# Altium schematic sheet RF_Bypass.SchDoc
size 279 x 215 mm; SheetNumber: 6; SheetTotal: 6
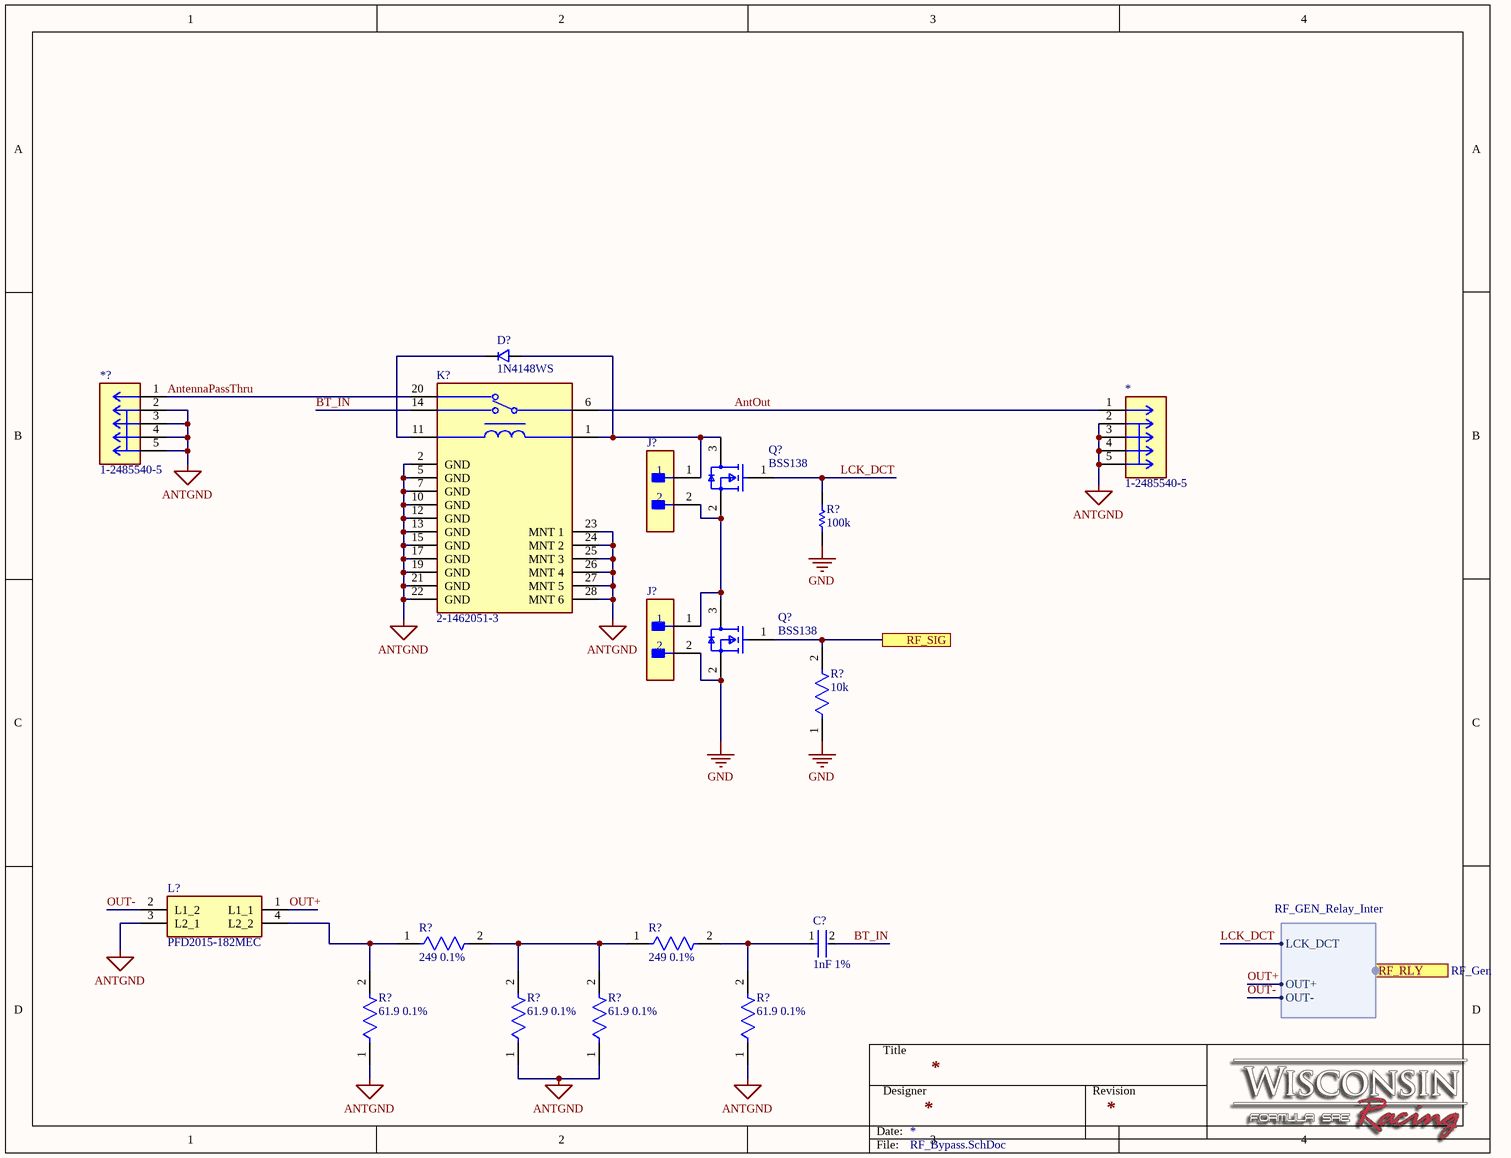
[diagram p0: RF_Bypass.SchDoc]

## Parts
(Parts that share a designator on the sheet are numbered #1, #2 ... from top to bottom, then left to right.)
*  1-2485540-5  [1-2485540-5-Footprint-1]
*?  1-2485540-5  [1-2485540-5-Footprint-1]
C?  1nF 1%  [FP-GRT155-0_05-IPC_A]
D?  1N4148WS  [SODFL250X90-2N]
J?#1  TSM-102-01-T-SV-TR  [FP-TSM-102-01-T-SV-TR-MFG]  (value not drawn)
J?#2  TSM-102-01-T-SV-TR  [FP-TSM-102-01-T-SV-TR-MFG]  (value not drawn)
K?  2-1462051-3  [FP-2-1462051-3-MFG]
L?  PFD2015-182MEC  [PFD2015102MEB]
Q?#1  BSS138  [FP-318-08-IPC_B]
Q?#2  BSS138  [FP-318-08-IPC_B]
R?#1  100k  [RESC1005X40X25NL05T10]
R?#2  10k  [FP-RC0402-0_4-IPC_C]
R?#3  249 0.1%  [FP-RT0402-MFG]
R?#4  249 0.1%  [FP-RT0402-MFG]
R?#5  61.9 0.1%  [FP-RP73P-1E-MFG]
R?#6  61.9 0.1%  [FP-RP73P-1E-MFG]
R?#7  61.9 0.1%  [FP-RP73P-1E-MFG]
R?#8  61.9 0.1%  [FP-RP73P-1E-MFG]

## Ports
RF_RLY (harness RF_GEN_Relay_Inter, see RF_Gen), RF_SIG

## Harnesses
RF_GEN_Relay_Inter: LCK_DCT, OUT+, OUT-

## Nets
ANTGND: *.2 *.3 *.4 *.5 *?.2 *?.3 *?.4 *?.5 K?.2(GND) K?.5(GND) K?.7(GND) K?.10(GND) K?.12(GND) K?.13(GND) K?.15(GND) K?.17(GND) K?.19(GND) K?.21(GND) K?.22(GND) K?.23(MNT_1) K?.24(MNT_2) K?.25(MNT_3) K?.26(MNT_4) K?.27(MNT_5) K?.28(MNT_6) L?.3(L2_1) R?#5.1 R?#6.1 R?#7.1 R?#8.1
GND: J?#2.2 Q?#2.2(S) R?#1.1 R?#2.1
AntennaPassThru: *?.1 K?.20
AntOut: *.1 K?.6
BT_IN: C?.2 K?.14
LCK_DCT: Q?#1.1(G) R?#1.2 ; port RF_RLY.LCK_DCT
OUT+: port RF_RLY.OUT+
OUT-: L?.2(L1_2) ; port RF_RLY.OUT-
RF_SIG: Q?#2.1(G) R?#2.2 ; port RF_SIG
NetC?_1: C?.1 R?#4.2 R?#8.2
NetD?_1: D?.1 K?.11(-)
NetD?_2: D?.2 J?#1.1 K?.1(+) Q?#1.3(D)
NetJ?#1_2: J?#1.2 J?#2.1 Q?#1.2(S) Q?#2.3(D)
NetL?_4: L?.4(L2_2) R?#3.1 R?#5.2
NetR?#3_2: R?#3.2 R?#4.1 R?#6.2 R?#7.2

Not connected (* = marked no-connect by the designer): L? 1(L1_1)

## Notes on the sheet
- Labels drawn without touching a wire or pin: OUT+
- Title
- Designer
- Revision
- Date:
- File:

## Library data of the parts
* *? = CMP-00172-1: FAKRA Connector, Plug, 50 ohm, Locking, 6 GHz, Cable-to-Board, 1 Position, Printed Circuit Board, -40 – 105 °C [-40 – 221 °F], Solder, FAKRA
C? = CMP-06035-012909-1: Multi-Layer Ceramic Capacitor 1nF 50V C0G ±1% 0402 Paper T/R / GRT1555C1H102FA02D
D? = CMP-REC-0001-6: Diode
J?#1 J?#2 = CMP-02766-000113-1: CONN HEADER SMD 2POS 2.54MM; Gender: Male; Max Voltage Rating (AC): 475V; Number of Contacts: 2; Max Current Rating: 7A; Contact Material: Bronze; Min Operating Temperature: -55°C; REACH SVHC: No SVHC; Housing Material: Polymer; Lead Free: Lead Free; Orientation: Straight; Radiation Hardening: No; Number of Rows: 1; Length: 5.08mm; Housing Color: Black; Max Operating Temperature: 105°C; Contact Plating: Tin; Depth: 2.54mm; Packaging: Tape and Reel; Pitch: 2.54mm; Termination: Solder
K? = CMP-03396-000136-1: RELAY RF SPDT 2A 5V; Max Voltage Rating (AC): 250V; Contact Voltage Rating (DC): 220V; Operate Time: 3ms; Actuating System: DC; Release Time: 5ms; Coil Resistance: 178R; Coil Current: 28.1mA; Insertion Loss: -0.3dB; Coil Power: 140mW; Coil Type: Non-Latching; Contact Current Rating: 2A; Radiation Hardening: No; Voltage Rating (AC): 250V; ELV: Compliant; Max Voltage Rating (DC): 220V; Min Operating Temperature: -55°C; Coil Voltage (DC): 5V; Number of Pins: 22; Max Current Rating: 2A; Height: 10.5mm; Package Quantity: 250; Termination: PCB; Length: 14.9inch; RoHS Compliant: No; Packaging: Box; Width: 0.295inch; Depth: 9.4mm; Relay Type: Relay; Mount: Surface Mount; Throw Configuration: SPDT; Contact Plating: Gold; Contact Material: Nickel; Weight: 3oz; Series: HF3S, AXICOM; Max Operating Temperature: 85°C
L? = PFD2015-102MEB: Inductor; Manufacturer_Name: COILCRAFT; Datasheet Link: https://www.coilcraft.com/pdfs/pfd2015_flyback.pdf; Height: 1.5mm; Manufacturer_Part_Number: PFD2015-102MEB; Mouser Part Number: 994-PFD2015-102MEB; Mouser Price/Stock: https://www.mouser.com/Search/Refine.aspx?Keyword=994-PFD2015-102MEB
Q?#1 Q?#2 = CMP-07173-000101-1: MOSFET N-CH 50V 220MA SOT-23; Turn-Off Delay Time: 20ns; Element Configuration: Single; Rds On Max: 3.5R; Gate to Source Voltage (Vgs): 20V; Threshold Voltage: 1.3V; Number of Elements: 1; Power Dissipation: 360mW; Rise Time: 9ns; Turn-On Delay Time: 2.5ns; Input Capacitance: 27pF; On-State Resistance: 6R; Lead Free: Lead Free; Length: 2.92mm; Width: 1.3mm; Drain to Source Breakdown Voltage: 50V; Min Operating Temperature: -55°C; REACH SVHC: No SVHC; Packaging: Tape and Reel; Radiation Hardening: No; Height: 0.93mm; Drain to Source Voltage (Vdss): 50V; Current Rating: 220mA; Voltage Rating (DC): 50V; Weight: 0.03g; Continuous Drain Current (ID): 220mA; Number of Pins: 3; Nominal Vgs: 1.3V; Max Power Dissipation: 360mW; Fall Time: 9ns; Drain to Source Resistance: 3.5R; Contact Plating: Tin; Case/Package: SOT-23; Package Quantity: 1; Dual Supply Voltage: 50V; Mount: Surface Mount; Termination: SMD/SMT; Max Operating Temperature: 150°C
R?#1 = CMP-2002-07343-1: Part Number: RC0402FR-07100KL; Manufacturer: Yageo / Phycomp
R?#2 = CMP-2002-07915-3: RES 10K OHM 5% 1/16W 0402; Max Power Dissipation: 63mW; Temperature Coefficient: 100ppm/°C; Power Rating: 62.5mW; Resistance: 10kR; Voltage Rating: 50V; Size Code: 0402; Resistance Tolerance: 5%; Packaging: Tape and Reel; Case Code (Metric): 1005; Lead Free: Lead Free; Resistor Type: Thick Film; Min Operating Temperature: -55°C; Military Standard: Not; Depth: 0.5mm; Series: RC; Case/Package: 0402; Construction: Rectangular; Number of Terminations: 2; Package Quantity: 1; Termination: SMD/SMT; Length: 0.039inch; Case Code (Imperial): 0402; Height: 0.016inch; Features: Moisture Resistant; RoHS Compliant: Yes; Max Operating Temperature: 155°C; Tolerance: 5%; Width: 0.02inch
R?#3 R?#4 = CMP-2002-02712-2: RES SMD 249 OHM 0.1% 1/16W 0402; Manufacturer: Yageo; Manufacturer Part Number: RT0402BRD07249RL; Temperature Coefficient: 25 ppm/°C; Power Rating: 0.063W; Description: RT0402 249Ω 0.063W 25 ppm/°C 0.10%; Value: 249Ω; Voltage Rating: 50V; Tolerance: 0.001; Footprint Url: http://www.yageo.com/exep/pages/download/literatures/PYu-R_Mount_10.pdf; Device Class L3: Chip SMD Resistors; Category: Res; Resistance: 249Ω; Device Class L2: Resistors; Height: 0.35mm; Device Class L1: Passive Components; Package: RT0402; Ipc Land Pattern Name: RESC10050X30; Temperature Range Low: -55°C; Lead Free: Yes; ComponentLink2Description: Datasheet; Octopart: https://octopart.com/rt0402brd07249rl-yageo-1467928; Digikey Description: RES SMD 249 OHM 0.1% 1/16W 0402; Automotive: No; Composition: Thin Film; Temperature: -55°C to +155°C; RoHS: TRUE; Temperature Range High: +155°C; Series: RT; Mouser Description: Thin Film Resistors - SMD 1/16W 249 ohm .1% 25ppm; ComponentLink2URL: http://www.yageo.com/documents/recent/PYu-RT_1-to-0.01_RoHS_L_9.pdf
R?#5-R?#8 = CMP-03211-009150-1: RP73P 0402 61.9Ω 0.1W 25ppm/°C 0.10% 50V; Manufacturer: TE Connectivity; Manufacturer Part Number: RP73PF1E61R9BTD; Temperature Coefficient: 25ppm/°C; Temperature: -55°C to +155°C; Voltage Rating: 50V; Composition: Thin Film; Value: 61.9Ω; Ipc Land Pattern Name: RESC10050X30; Device Class L3: Chip SMD Resistors; Resistance: 61.9Ω; Octopart: https://octopart.com/rp73pf1e61r9btd-te+connectivity-89230235; ComponentLink2URL: https://www.te.com/commerce/DocumentDelivery/DDEController?Action=srchrtrv&DocNm=1773272&DocType=DS&DocLang=English; RoHS: TRUE; Device Class L2: Resistors; Series: RP73P; Temperature Range Low: -55°C; Category: Res; ComponentLink2Description: Datasheet; Temperature Range High: +155°C; Height: 0.35mm; Lead Free: Yes; Automotive: No; Power Rating: 0.1W; Package: RP73P-1E; Device Class L1: Passive Components; Tolerance: 0.10%